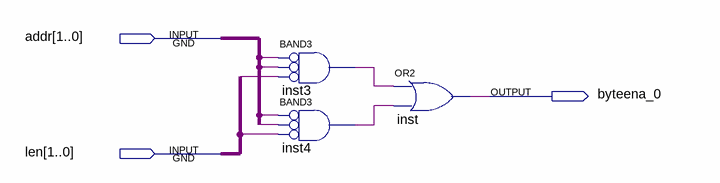
[diagram p0: schematic sheet]
// Quartus schematic byteena_0.bdf as structural Verilog: 3 symbols, 3 pins
module byteena_0 (
  input  [1:0] addr,
  input  [1:0] len,
  output byteena_0
);

  wire inst3_out, inst4_out;

  and inst3 (inst3_out, ~addr[1], ~addr[0], ~len[1]);  // BAND3
  and inst4 (inst4_out, ~addr[1], ~addr[0], ~len[0]);  // BAND3
  or inst (byteena_0, inst3_out, inst4_out);

  // Other names for the same wires on the sheet: a[1:0] = addr; l[1:0] = len
endmodule
